# Altium schematic sheet Sensor.SchDoc
size A
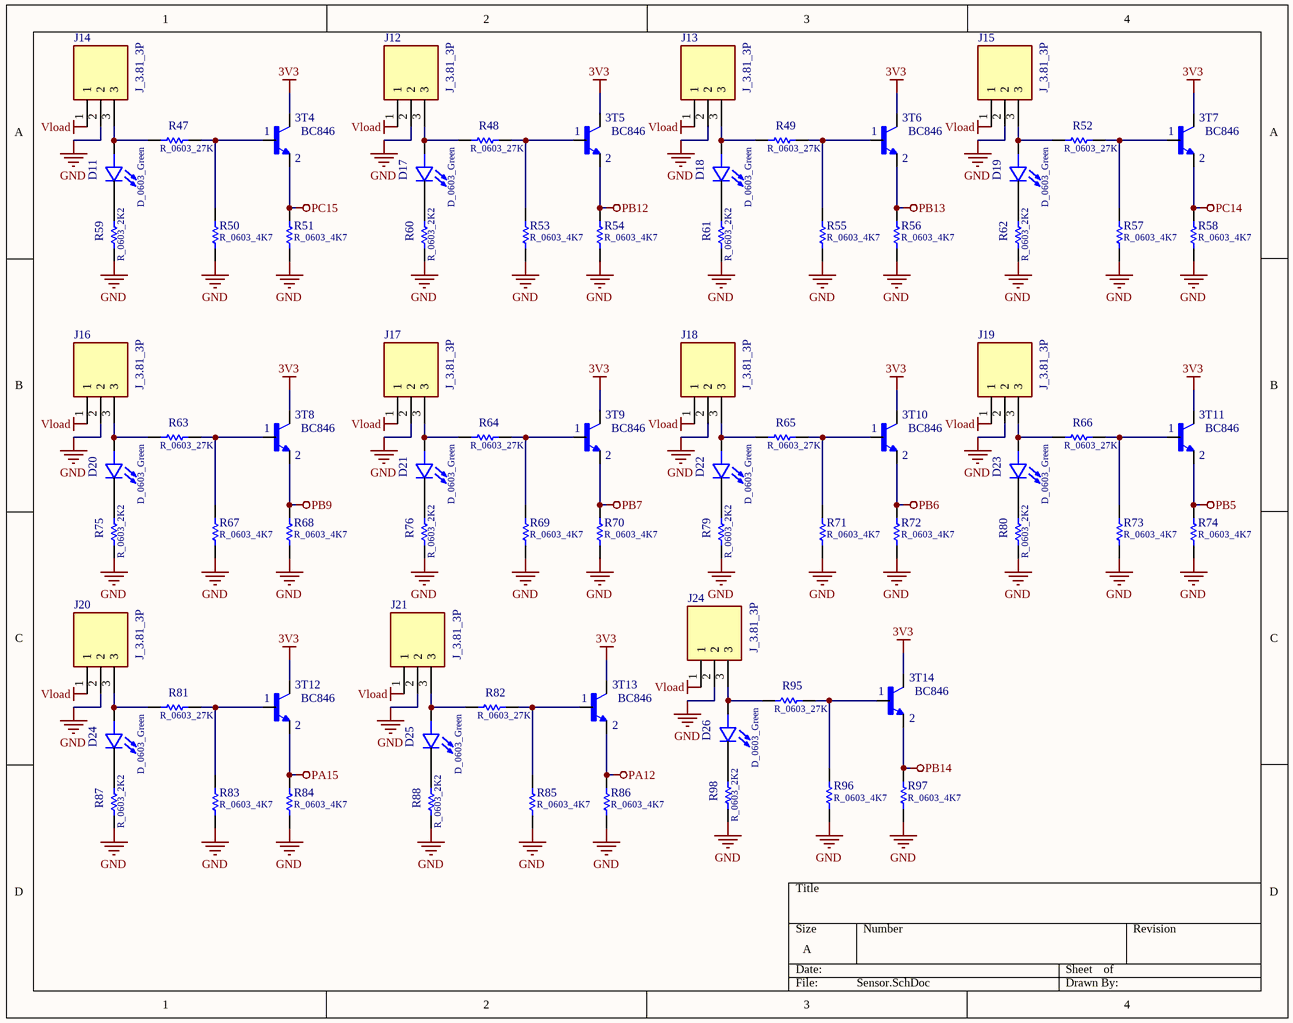
[diagram p0: Sensor.SchDoc]

## Parts
D11  D_0603_Green  [Led 0603]
D17  D_0603_Green  [Led 0603]
D18  D_0603_Green  [Led 0603]
D19  D_0603_Green  [Led 0603]
D20  D_0603_Green  [Led 0603]
D21  D_0603_Green  [Led 0603]
D22  D_0603_Green  [Led 0603]
D23  D_0603_Green  [Led 0603]
D24  D_0603_Green  [Led 0603]
D25  D_0603_Green  [Led 0603]
D26  D_0603_Green  [Led 0603]
J12  J_3.81_3P  [3 Pin PCB TB 3.81]
J13  J_3.81_3P  [3 Pin PCB TB 3.81]
J14  J_3.81_3P  [3 Pin PCB TB 3.81]
J15  J_3.81_3P  [3 Pin PCB TB 3.81]
J16  J_3.81_3P  [3 Pin PCB TB 3.81]
J17  J_3.81_3P  [3 Pin PCB TB 3.81]
J18  J_3.81_3P  [3 Pin PCB TB 3.81]
J19  J_3.81_3P  [3 Pin PCB TB 3.81]
J20  J_3.81_3P  [3 Pin PCB TB 3.81]
J21  J_3.81_3P  [3 Pin PCB TB 3.81]
J24  J_3.81_3P  [3 Pin PCB TB 3.81]
R47  R_0603_27K  [RES 0603]
R48  R_0603_27K  [RES 0603]
R49  R_0603_27K  [RES 0603]
R50  R_0603_4K7  [RES 0603]
R51  R_0603_4K7  [RES 0603]
R52  R_0603_27K  [RES 0603]
R53  R_0603_4K7  [RES 0603]
R54  R_0603_4K7  [RES 0603]
R55  R_0603_4K7  [RES 0603]
R56  R_0603_4K7  [RES 0603]
R57  R_0603_4K7  [RES 0603]
R58  R_0603_4K7  [RES 0603]
R59  R_0603_2K2  [RES 0603]
R60  R_0603_2K2  [RES 0603]
R61  R_0603_2K2  [RES 0603]
R62  R_0603_2K2  [RES 0603]
R63  R_0603_27K  [RES 0603]
R64  R_0603_27K  [RES 0603]
R65  R_0603_27K  [RES 0603]
R66  R_0603_27K  [RES 0603]
R67  R_0603_4K7  [RES 0603]
R68  R_0603_4K7  [RES 0603]
R69  R_0603_4K7  [RES 0603]
R70  R_0603_4K7  [RES 0603]
R71  R_0603_4K7  [RES 0603]
R72  R_0603_4K7  [RES 0603]
R73  R_0603_4K7  [RES 0603]
R74  R_0603_4K7  [RES 0603]
R75  R_0603_2K2  [RES 0603]
R76  R_0603_2K2  [RES 0603]
R79  R_0603_2K2  [RES 0603]
R80  R_0603_2K2  [RES 0603]
R81  R_0603_27K  [RES 0603]
R82  R_0603_27K  [RES 0603]
R83  R_0603_4K7  [RES 0603]
R84  R_0603_4K7  [RES 0603]
R85  R_0603_4K7  [RES 0603]
R86  R_0603_4K7  [RES 0603]
R87  R_0603_2K2  [RES 0603]
R88  R_0603_2K2  [RES 0603]
R95  R_0603_27K  [RES 0603]
R96  R_0603_4K7  [RES 0603]
R97  R_0603_4K7  [RES 0603]
R98  R_0603_2K2  [RES 0603]
T4  BC846  [SOT23]
T5  BC846  [SOT23]
T6  BC846  [SOT23]
T7  BC846  [SOT23]
T8  BC846  [SOT23]
T9  BC846  [SOT23]
T10  BC846  [SOT23]
T11  BC846  [SOT23]
T12  BC846  [SOT23]
T13  BC846  [SOT23]
T14  BC846  [SOT23]

## Nets
3V3: T4.3(C) T5.3(C) T6.3(C) T7.3(C) T8.3(C) T9.3(C) T10.3(C) T11.3(C) T12.3(C) T13.3(C) T14.3(C)
GND: J12.2 J13.2 J14.2 J15.2 J16.2 J17.2 J18.2 J19.2 J20.2 J21.2 J24.2 R50.1 R51.1 R53.1 R54.1 R55.1 R56.1 R57.1 R58.1 R59.1 R60.1 R61.1 R62.1 R67.1 R68.1 R69.1 R70.1 R71.1 R72.1 R73.1 R74.1 R75.1 R76.1 R79.1 R80.1 R83.1 R84.1 R85.1 R86.1 R87.1 R88.1 R96.1 R97.1 R98.1
PA12: R86.2 T13.2(E)
PA15: R84.2 T12.2(E)
PB5: R74.2 T11.2(E)
PB6: R72.2 T10.2(E)
PB7: R70.2 T9.2(E)
PB9: R68.2 T8.2(E)
PB12: R54.2 T5.2(E)
PB13: R56.2 T6.2(E)
PB14: R97.2 T14.2(E)
PC14: R58.2 T7.2(E)
PC15: R51.2 T4.2(E)
Vload: J12.1 J13.1 J14.1 J15.1 J16.1 J17.1 J18.1 J19.1 J20.1 J21.1 J24.1
NetD11_1: D11.1(A) J14.3 R47.2
NetD11_2: D11.2(C) R59.2
NetD17_1: D17.1(A) J12.3 R48.2
NetD17_2: D17.2(C) R60.2
NetD18_1: D18.1(A) J13.3 R49.2
NetD18_2: D18.2(C) R61.2
NetD19_1: D19.1(A) J15.3 R52.2
NetD19_2: D19.2(C) R62.2
NetD20_1: D20.1(A) J16.3 R63.2
NetD20_2: D20.2(C) R75.2
NetD21_1: D21.1(A) J17.3 R64.2
NetD21_2: D21.2(C) R76.2
NetD22_1: D22.1(A) J18.3 R65.2
NetD22_2: D22.2(C) R79.2
NetD23_1: D23.1(A) J19.3 R66.2
NetD23_2: D23.2(C) R80.2
NetD24_1: D24.1(A) J20.3 R81.2
NetD24_2: D24.2(C) R87.2
NetD25_1: D25.1(A) J21.3 R82.2
NetD25_2: D25.2(C) R88.2
NetD26_1: D26.1(A) J24.3 R95.2
NetD26_2: D26.2(C) R98.2
NetR47_1: R47.1 R50.2 T4.1(B)
NetR48_1: R48.1 R53.2 T5.1(B)
NetR49_1: R49.1 R55.2 T6.1(B)
NetR52_1: R52.1 R57.2 T7.1(B)
NetR63_1: R63.1 R67.2 T8.1(B)
NetR64_1: R64.1 R69.2 T9.1(B)
NetR65_1: R65.1 R71.2 T10.1(B)
NetR66_1: R66.1 R73.2 T11.1(B)
NetR81_1: R81.1 R83.2 T12.1(B)
NetR82_1: R82.1 R85.2 T13.1(B)
NetR95_1: R95.1 R96.2 T14.1(B)

## Library data of the parts
D11 D17-D26 = Led: MP: SML-D12FWT86; MF: Rohm; Price: None; Availability: In Stock; Package: 0603 Rohm; SnapEDA_Link: https://www.snapeda.com/parts/SML-D12FWT86/Rohm/view-part/?ref=snap; Check_prices: https://www.snapeda.com/parts/SML-D12FWT86/Rohm/view-part/?ref=eda; Value: *; Purchase-URL: https://pricing.snapeda.com/search/part/SML-D12FWT86/?ref=eda
J12-J21 J24 = 3 Pin PCB Terminal Block: MF: {'manufacturer': u'CUI'}; MP: TBP02R1-381-03BE; Price: None; Package: None; Value: *; Availability: Unavailable
R47-R76 R79-R88 R95-R98 = Res: Resistor; Published: 8-Jun-2000; LatestRevisionDate: 17-Jul-2002; LatestRevisionNote: Re-released for DXP Platform.; Publisher: Altium Limited
T4-T14 = BC846: TRANSISTOR, NPN, 0.1A, 65V, SOT23; Transistor Polarity:NPN; Collector Emitter Voltage V(br)ceo:65V; Transition Frequency Typ ft:100MHz; Power Dissipation Pd:250mW; DC Collector Current:100mA; DC Current Gain hFE:110; Operating Temperature Min:-55Â°C; Operating Temperature Max:150Â°C; Transistor Case Style:SOT-23; No. of Pins:3; DC Current Gain Hfe Max:450; Operating Temperature Range:-55Â°C to +150Â°C; MF: ON Semiconductor; MP: BC846; Value: *; SnapEDA_Link: https://www.snapeda.com/parts/BC846/Onsemi/view-part/?ref=snap; Availability: In Stock; Purchase-URL: https://pricing.snapeda.com/search/part/BC846/?ref=eda; Package: SOT-23-3 Panasonic Electronic; Price: None; Check_prices: https://www.snapeda.com/parts/BC846/Onsemi/view-part/?ref=eda